# Altium schematic sheet uC.SchDoc
size A; SheetNumber: 2; SheetTotal: 5
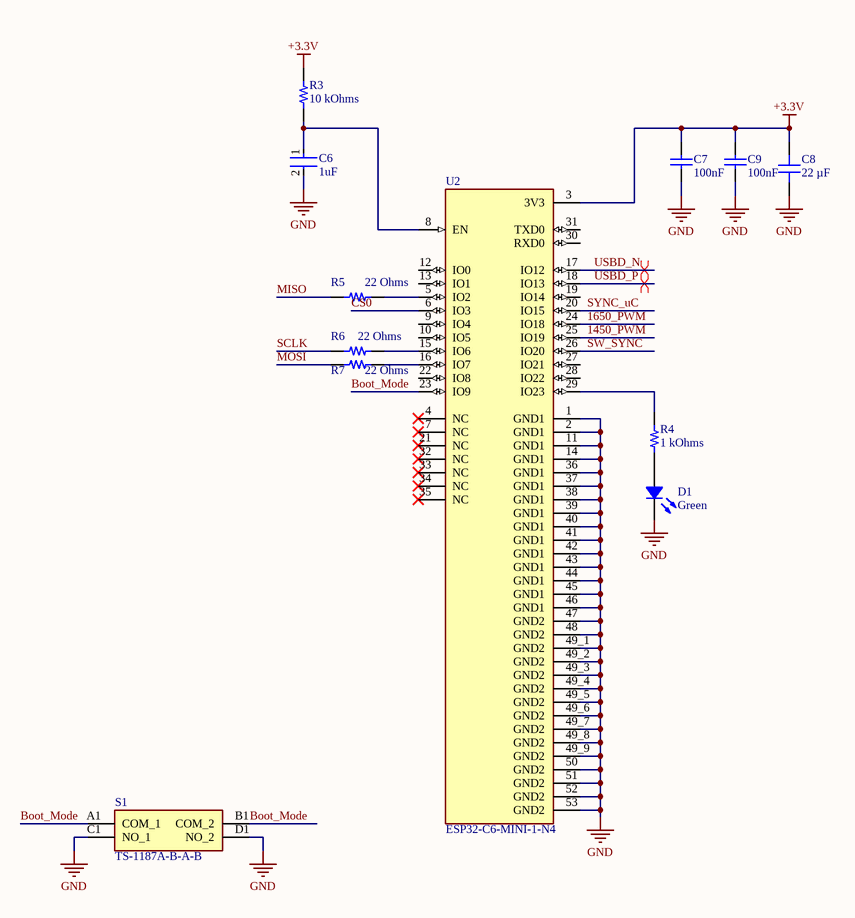
[diagram p0: uC.SchDoc]

## Parts
C6  1uF  [FP-CL542-IPC_C]
C7  100nF  [CAPC1050X55X23ML05T13]
C8  22 µF  [CAP 0603_1608]
C9  100nF  [CAPC1050X55X23ML05T13]
D1  Green  [LED 0805_2012 GREEN]
R3  10 kOhms  [RES 0402_1005]
R4  1 kOhms  [RES 0402_1005]
R5  22 Ohms  [RES 0402_1005]
R6  22 Ohms  [RES 0402_1005]
R7  22 Ohms  [RES 0402_1005]
S1  TS-1187A-B-A-B  [TS1187ABAB]
U2  ESP32-C6-MINI-1-N4  [XCVR_ESP32-C6-MINI-1-N4]

## Nets
+3.3V: C7.2 C8.2 C9.2 R3.2 U2.3(3V3)
GND: C6.2 C7.1 C8.1 C9.1 D1.2 S1.C1(NO_1) S1.D1(NO_2) U2.1(GND1) U2.2(GND1) U2.11(GND1) U2.14(GND1) U2.36(GND1) U2.37(GND1) U2.38(GND1) U2.39(GND1) U2.40(GND1) U2.41(GND1) U2.42(GND1) U2.43(GND1) U2.44(GND1) U2.45(GND1) U2.46(GND1) U2.47(GND2) U2.48(GND2) U2.49_1(GND2) U2.49_2(GND2) U2.49_3(GND2) U2.49_4(GND2) U2.49_5(GND2) U2.49_6(GND2) U2.49_7(GND2) U2.49_8(GND2) U2.49_9(GND2) U2.50(GND2) U2.51(GND2) U2.52(GND2) U2.53(GND2)
1450_PWM: U2.25(IO19)
1650_PWM: U2.24(IO18)
Boot_Mode: S1.A1(COM_1) S1.B1(COM_2) U2.23(IO9)
CS0: U2.6(IO3)
MISO: R5.1
MOSI: R7.1
SCLK: R6.1
SW_SYNC: U2.26(IO20)
SYNC_uC: U2.20(IO15)
USBD_N: U2.17(IO12)
USBD_P: U2.18(IO13)
NetC6_1: C6.1 R3.1 U2.8(EN)
NetD1_1: D1.1 R4.1
NetR4_2: R4.2 U2.29(IO23)
NetR5_2: R5.2 U2.5(IO2)
NetR6_2: R6.2 U2.15(IO6)
NetR7_2: R7.2 U2.16(IO7)

Not connected (* = marked no-connect by the designer): U2 4(NC)* 7(NC)* 9(IO4) 10(IO5) 12(IO0) 13(IO1) 19(IO14) 21(NC)* 22(IO8) 27(IO21) 28(IO22) 30(RXD0) 31(TXD0) 32(NC)* 33(NC)* 34(NC)* 35(NC)*

## Layout directives
differential pair: USBD_N, USBD_P

## Library data of the parts
C6 = CMP-13271-001051-1: Cap Ceramic 1uF 25V X5R ±10% SMD 0402 +85°C Paper T/R; Radiation Hardening: No; Lead Free: Lead Free; Capacitance: 1uF; Package Quantity: 10000; Max Operating Temperature: 85°C; Voltage Rating: 25V; Case/Package: 0402; Min Operating Temperature: -55°C; Packaging: Tape and Reel; Tolerance: 10%; Height: 0.5mm; Thickness: 0.022inch; Case Code (Metric): 1005; Width: 0.02inch; Case Code (Imperial): 0402; Dielectric: X5R; Length: 1mm; Mount: Surface Mount; Material: Ceramic; Depth: 0.5mm
C7 C9 = CMP-2000-05439-1: Chip Capacitor, 100 nF, +/- 10%, 16 V, -55 to 125 degC, 0402 (1005 Metric), RoHS, Tape and Reel; Manufacturer: Samsung Electro-Mechanics; Capacitance: 100000pF; Dielectric: X7R; Rated Voltage: 16V; Case Size/Dimension: 0402; Tolerance (%): ±10%; Manufacturer URL: http://www.samsungsem.com/global/index.jsp; Datasheet URL: https://datasheet.ciiva.com/29198/458718-da-01-en-vs-kondensator-0402-29198423.pdf; Datasheet Version: Nov-10
C8 = CL10A226KQ8NRNE: CAP CER 22UF 6.3V X5R 0603; manufacturer: Samsung Electro-Mechanics; Tolerance: ±10%; Part Number: CL10A226KQ8NRNE; Value: 22 µF; Applications: General Purpose; Capacitance: 22 µF; componentlink1description: Datasheet; componentlink1url: http://www.samsungsem.com/kr/support/product-search/mlcc/CL10A226KQ8NRNE.jsp; componentlink2description: DigiKey Link; componentlink2url: https://www.digikey.com/en/products/detail/samsung-electro-mechanics/CL10A226KQ8NRNE/3888525; Device Package: 0603 (1608 Metric); lastupdated: 2/9/2024 8:10:30 PM; Lifecycle Status: Active; Minimum Order: 1; Mounting Type: Surface Mount, MLCC; Operating Temperature: -55°C ~ 85°C; Package / Case: 0603 (1608 Metric); packaging: TapeAndReel; partid: 2682; Part Status: Active; price: 0.10; series: CL; Size / Dimension: 0.063" L x 0.031" W (1.60mm x 0.80mm); Supplier 1: DigiKey; Supplier Part Number 1: 1276-2867-1-ND; Temperature Coefficient: X5R; Thickness (Max): 0.035" (0.90mm); Voltage - Rated: 6.3V
D1 = SM0805GC: LED GREEN CLEAR 0805 SMD KT0805G; Manufacturer: Bivar Inc.; Configuration: Standard; Current - Test: 20mA; Lens Color: Colorless; Lens Size: 1.40mm x 1.20mm; Lens Style: Rectangle with Flat Top; Millicandela Rating: 15mcd; Viewing Angle: 130°; Voltage - Forward (Vf) (Typ): 2.1V; Wavelength - Dominant: 565nm; Wavelength - Peak: 568nm; Part Number: SM0805GC; Color: Green; ComponentLink1Description: Datasheet; ComponentLink1URL: https://www.bivar.com/Files/Datasheets/SM0805GC.pdf; ComponentLink2Description: DigiKey Link; ComponentLink2URL: https://www.digikey.com/en/products/detail/bivar-inc/SM0805GC/3095526; Device Package: 0805 (2012 Metric); Height (Max): 1.10mm; LastUpdated: 6/3/2024 8:00:29 PM; Lens Transparency: Clear; Lifecycle Status: Active; Minimum Order: 1; Mounting Type: Surface Mount; Package / Case: 0805 (2012 Metric); Packaging: TapeAndReel; PartId: 266; Part Status: Active; Price: 0.28; Series: -; Size / Dimension: 2.00mm L x 1.20mm W; Supplier 1: DigiKey; Supplier Part Number 1: 492-1696-1-ND; Supplier Device Package: 0805; Value: Green
R3 = CRCW040210K0FKEE: RES SMD 10K OHM 1% 1/16W 0402; Manufacturer: Vishay Dale; Power (Watts): 0.063W, 1/16W; Temperature Coefficient: ±100ppm/°C; Part Number: CRCW040210K0FKEE; Value: 10 kOhms; ComponentLink1Description: Datasheet; ComponentLink1URL: http://www.vishay.com/docs/20035/dcrcwe3.pdf; ComponentLink2Description: DigiKey Link; ComponentLink2URL: https://www.digikey.com/en/products/detail/vishay-dale/CRCW040210K0FKEE/5069897; Composition: Thick Film; Device Package: 0402 (1005 Metric); Features: Automotive AEC-Q200; Height - Seated (Max): 0.016" (0.40mm); LastUpdated: 2/9/2024 8:30:20 PM; Lifecycle Status: Active; Minimum Order: 1; Number of Terminations: 2; Operating Temperature: -55°C ~ 155°C; Package / Case: 0402 (1005 Metric); Packaging: CutTape; PartId: 3471; Part Status: Active; Price: 0.01; Ratings: AEC-Q200; Resistance: 10 kOhms; Series: CRCW; Size / Dimension: 0.039" L x 0.020" W (1.00mm x 0.50mm); Supplier 1: DigiKey; Supplier Part Number 1: 541-2954-1-ND; Supplier Device Package: 0402; Tolerance: ±1%
R4 = CPF0402B1K0E: RES SMD 1K OHM 0.1% 1/16W 0402; Manufacturer: TE Connectivity Passive Product; Power (Watts): 0.063W, 1/16W; Temperature Coefficient: ±25ppm/°C; Part Number: CPF0402B1K0E; Value: 1 kOhms; ComponentLink1Description: Datasheet; ComponentLink1URL: https://www.te.com/commerce/DocumentDelivery/DDEController?Action=srchrtrv&DocNm=1773200&DocType=DS&DocLang=English; ComponentLink2Description: DigiKey Link; ComponentLink2URL: https://www.digikey.com/en/products/detail/te-connectivity-passive-product/CPF0402B1K0E/4966468; Composition: Thin Film; Device Package: 0402 (1005 Metric); Height - Seated (Max): 0.014" (0.35mm); LastUpdated: 2/9/2024 8:30:24 PM; Lifecycle Status: Active; Minimum Order: 1; Number of Terminations: 2; Operating Temperature: -55°C ~ 155°C; Package / Case: 0402 (1005 Metric); Packaging: TapeAndReel; PartId: 2470; Part Status: Active; Price: 0.10; Resistance: 1 kOhms; Series: CPF, Neohm; Size / Dimension: 0.039" L x 0.020" W (1.00mm x 0.50mm); Supplier 1: DigiKey; Supplier Part Number 1: A119928CT-ND; Supplier Device Package: 0402; Tolerance: ±0.1%
R5-R7 = RR0510R-220-D: RES SMD 22 OHM 0.5% 1/16W 0402; Manufacturer: Susumu; Power (Watts): 0.063W, 1/16W; Temperature Coefficient: ±100ppm/°C; Part Number: RR0510R-220-D; Value: 22 Ohms; ComponentLink1Description: Datasheet; ComponentLink1URL: http://www.susumu.co.jp/common/pdf/n_catalog_partition05_en.pdf; ComponentLink2Description: DigiKey Link; ComponentLink2URL: https://www.digikey.com/en/products/detail/susumu/RR0510R-220-D/567231; Composition: Thin Film; Device Package: 0402 (1005 Metric); Height - Seated (Max): 0.016" (0.40mm); LastUpdated: 2/9/2024 8:30:21 PM; Lifecycle Status: Active; Minimum Order: 1; Number of Terminations: 2; Operating Temperature: -55°C ~ 125°C; Package / Case: 0402 (1005 Metric); Packaging: TapeAndReel; PartId: 3266; Part Status: Active; Price: 0.01; Resistance: 22 Ohms; Series: RR; Size / Dimension: 0.039" L x 0.020" W (1.00mm x 0.50mm); Supplier 1: DigiKey; Supplier Part Number 1: RR05R22DCT-ND; Tolerance: ±0.5%
S1 = TS-1187A-B-A-B: Switch; Manufacturer_Name: XKB Connectivity; Datasheet Link: http://www.helloxkb.com/public/images/pdf/TS-1187A-X-X-X.pdf; Height: 4.05mm; Manufacturer_Part_Number: TS-1187A-B-A-B
U2 = ESP32-C6-MINI-1-N4: 802.15.4, Bluetooth, WiFi 802.11ax, Bluetooth v5.0, ZigbeeÂ® Transceiver Module 2.4GHz Antenna Not Included Surface Mount; MF: Espressif Systems; SnapEDA_Link: https://www.snapeda.com/parts/ESP32-C6-MINI-1-N4/Espressif+Systems/view-part/?ref=snap; Package: SMD-53 Espressif Systems; Value: *; MP: ESP32-C6-MINI-1-N4; Check_prices: https://www.snapeda.com/parts/ESP32-C6-MINI-1-N4/Espressif+Systems/view-part/?ref=eda